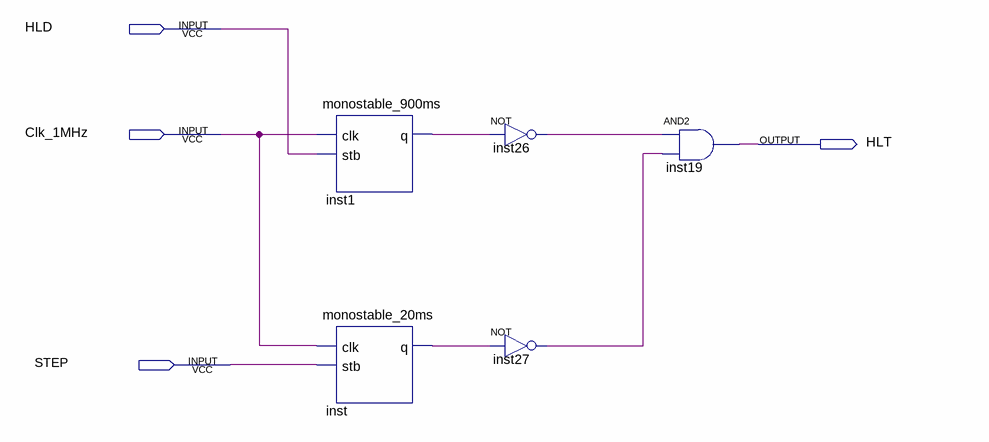
[diagram p0: schematic sheet]
// Quartus schematic HLT_8877.bdf as structural Verilog: 5 symbols, 4 pins
module HLT_8877 (
  input  HLD,
  input  Clk_1MHz,
  input  STEP,
  output HLT
);

  wire inst1_q, inst26_out, inst27_out, inst_q;

  monostable_900ms inst1 (.clk(Clk_1MHz), .stb(HLD), .q(inst1_q));
  monostable_20ms inst (.clk(Clk_1MHz), .stb(STEP), .q(inst_q));
  not inst26 (inst26_out, inst1_q);
  not inst27 (inst27_out, inst_q);
  and inst19 (HLT, inst26_out, inst27_out);
endmodule
